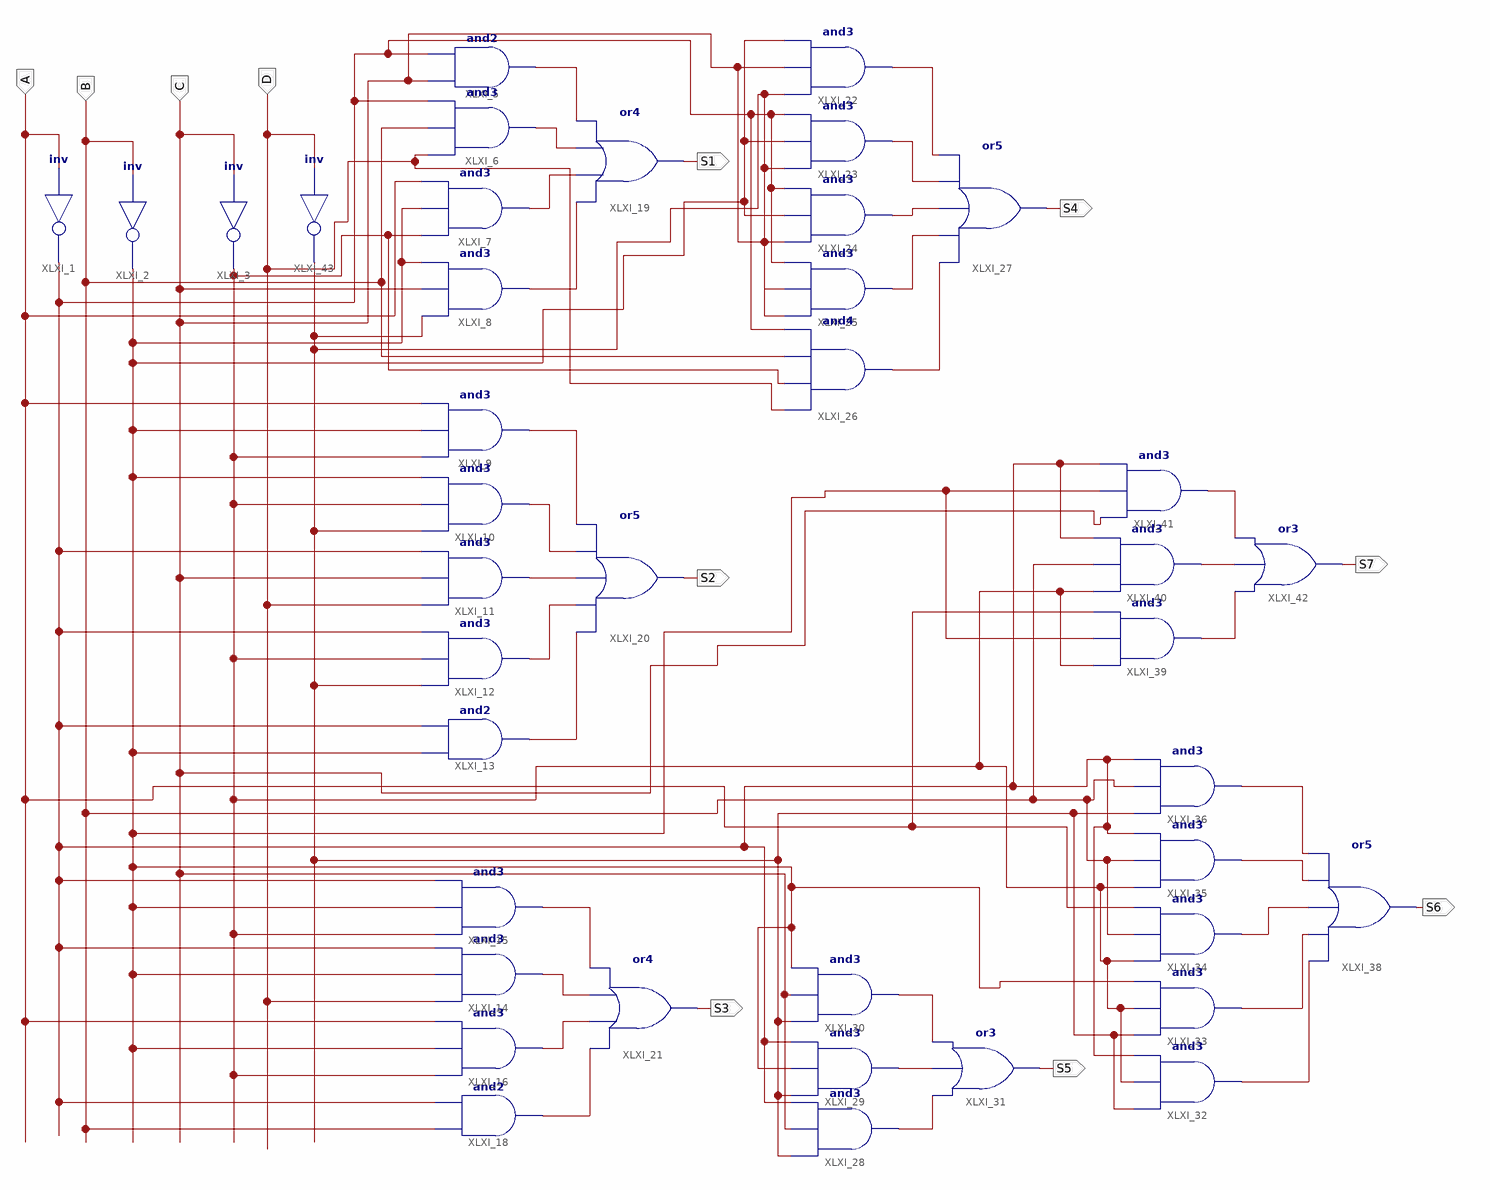
[diagram p0: schematic sheet 1]
// Xilinx ISE schematic BCD_7_SEGMENT.sch (spartan3e) as structural Verilog: 40 symbols, 11 ports
module BCD_7_SEGMENT (
  input  A,
  input  B,
  input  C,
  input  D,
  output S1,
  output S2,
  output S3,
  output S4,
  output S5,
  output S7,
  output S6
);

  wire XLXN_16, XLXN_17, XLXN_18, XLXN_19, XLXN_20, XLXN_21, XLXN_22, XLXN_23, XLXN_24, XLXN_25, XLXN_26,
       XLXN_27, XLXN_28, XLXN_29, XLXN_30, XLXN_31, XLXN_32, XLXN_33, XLXN_38, XLXN_39, XLXN_40, XLXN_41,
       XLXN_42, XLXN_43, XLXN_44, XLXN_45, XLXN_46, XLXN_47, XLXN_48, XLXN_63, XLXN_71, XLXN_72;

  not XLXI_1 (XLXN_63, A);
  not XLXI_2 (XLXN_71, B);
  not XLXI_3 (XLXN_72, C);
  and XLXI_5 (XLXN_16, C, XLXN_63);
  and XLXI_6 (XLXN_17, D, B, XLXN_63);
  and XLXI_7 (XLXN_18, XLXN_72, XLXN_71, A);
  and XLXI_8 (XLXN_19, D, C, XLXN_71);
  and XLXI_9 (XLXN_20, XLXN_72, XLXN_71, A);
  and XLXI_10 (XLXN_21, D, XLXN_72, XLXN_71);
  and XLXI_11 (XLXN_22, D, C, XLXN_63);
  and XLXI_12 (XLXN_23, D, XLXN_72, XLXN_63);
  and XLXI_13 (XLXN_24, XLXN_71, XLXN_63);
  and XLXI_14 (XLXN_26, D, XLXN_71, XLXN_63);
  and XLXI_15 (XLXN_25, XLXN_72, XLXN_71, XLXN_63);
  and XLXI_16 (XLXN_27, XLXN_72, XLXN_71, A);
  and XLXI_18 (XLXN_28, B, XLXN_63);
  or XLXI_19 (S1, XLXN_19, XLXN_18, XLXN_17, XLXN_16);
  or XLXI_20 (S2, XLXN_24, XLXN_23, XLXN_22, XLXN_21, XLXN_20);
  or XLXI_21 (S3, XLXN_28, XLXN_27, XLXN_26, XLXN_25);
  and XLXI_22 (XLXN_40, D, C, XLXN_71);
  and XLXI_23 (XLXN_39, D, XLXN_71, XLXN_63);
  and XLXI_24 (XLXN_38, C, XLXN_71, XLXN_63);
  and XLXI_25 (XLXN_33, D, C, XLXN_63);
  and XLXI_26 (XLXN_32, D, XLXN_72, B, XLXN_63);
  or XLXI_27 (S4, XLXN_32, XLXN_33, XLXN_38, XLXN_39, XLXN_40);
  and XLXI_28 (XLXN_29, D, C, XLXN_63);
  and XLXI_29 (XLXN_30, D, XLXN_71, XLXN_63);
  and XLXI_30 (XLXN_31, D, C, XLXN_71);
  or XLXI_31 (S5, XLXN_29, XLXN_30, XLXN_31);
  and XLXI_32 (XLXN_48, D, XLXN_72, XLXN_63);
  and XLXI_33 (XLXN_47, D, XLXN_72, XLXN_71);
  and XLXI_34 (XLXN_46, XLXN_72, B, A);
  and XLXI_35 (XLXN_45, XLXN_72, B, XLXN_63);
  and XLXI_36 (XLXN_44, D, B, XLXN_63);
  or XLXI_38 (S6, XLXN_48, XLXN_47, XLXN_46, XLXN_45, XLXN_44);
  and XLXI_39 (XLXN_43, XLXN_72, XLXN_71, A);
  and XLXI_40 (XLXN_42, XLXN_72, B, XLXN_63);
  and XLXI_41 (XLXN_41, C, XLXN_71, XLXN_63);
  or XLXI_42 (S7, XLXN_43, XLXN_42, XLXN_41);
  not XLXI_43 (D, D);
endmodule
